# EAGLE design Mega_Shield-v13 (EAGLE 7.4.0)
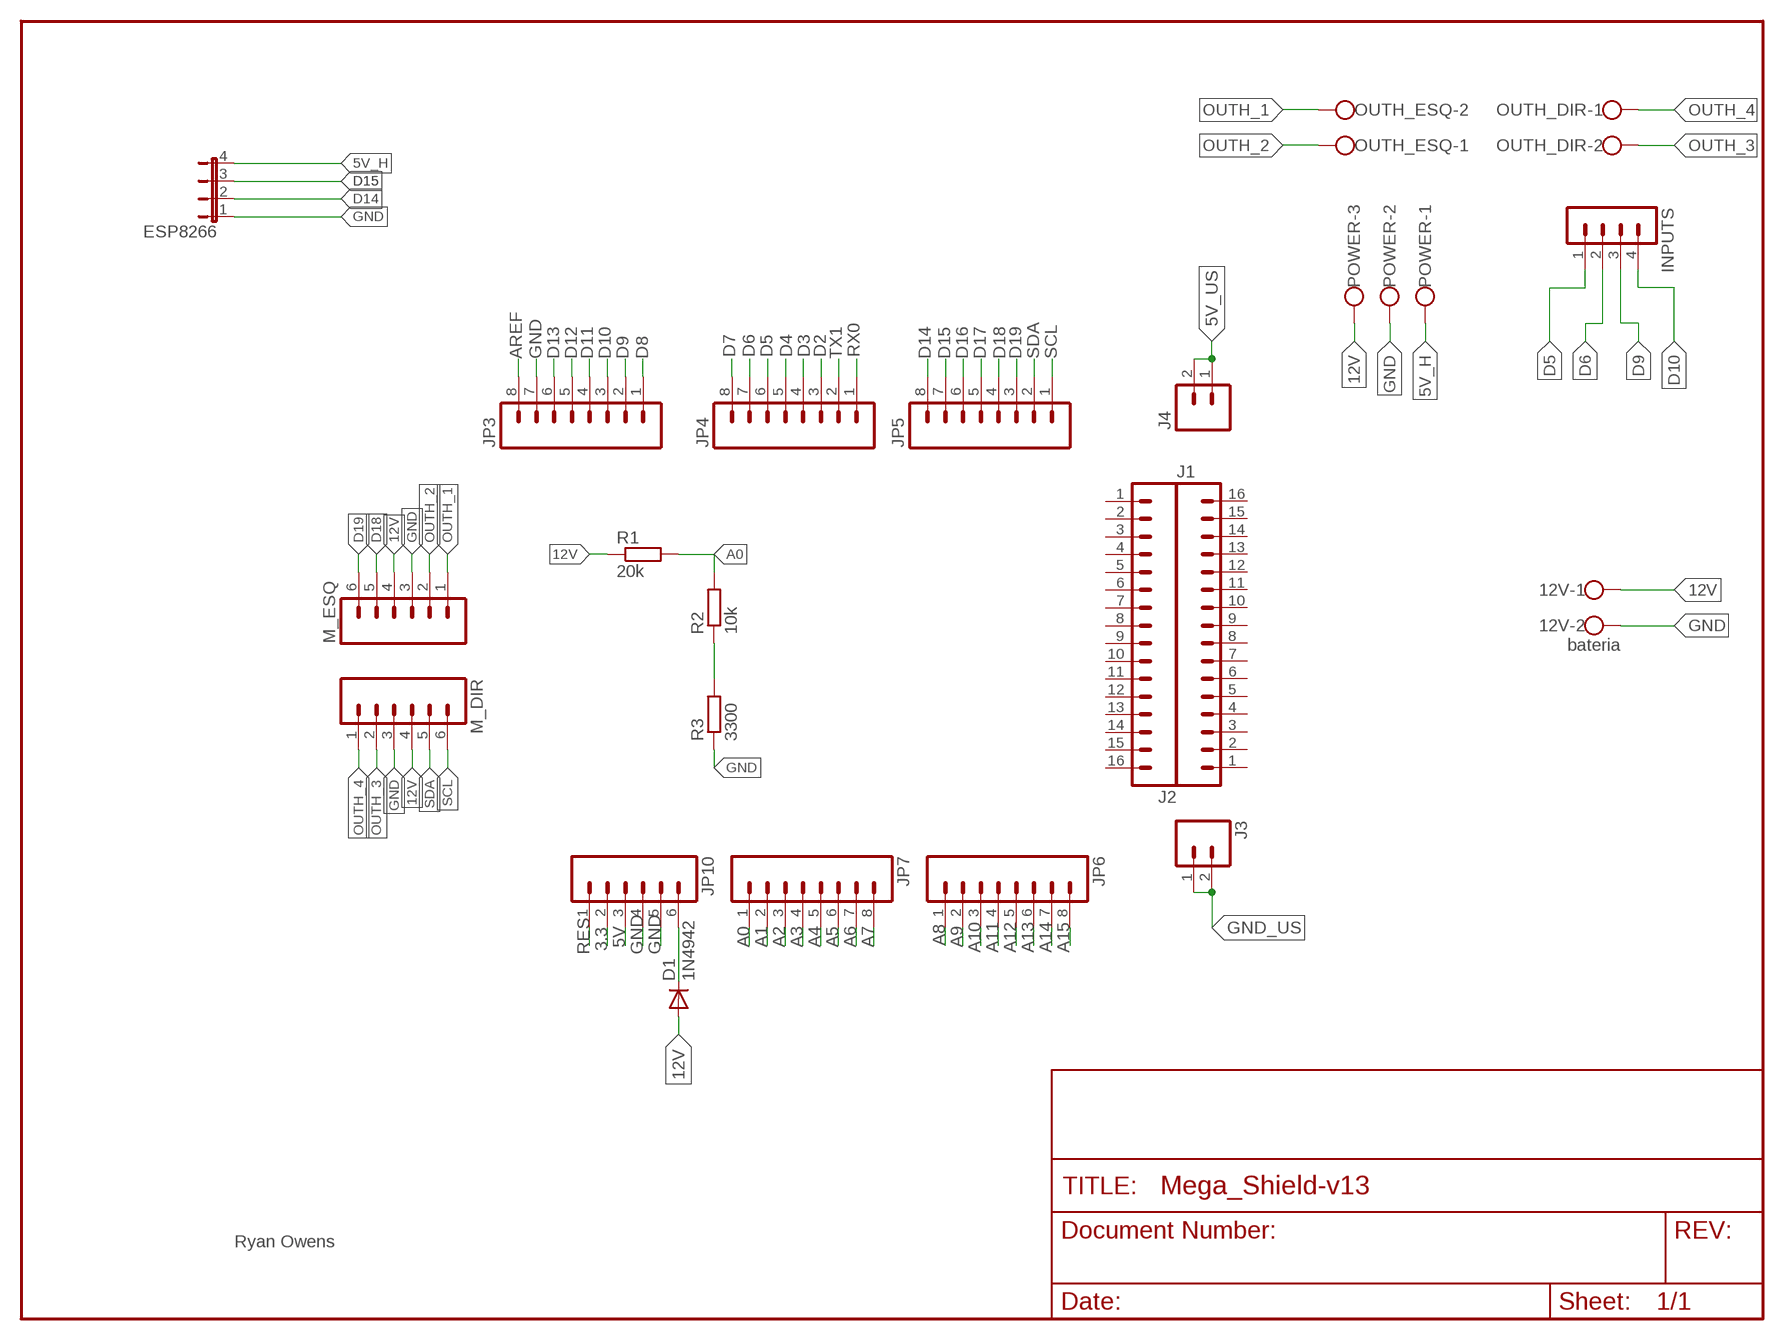
[diagram p0: schematic, sheet 1]

## Parts
12V  bateria  W237-102  [W237-102]
D1  1N4942  [DO41-10]
ESP8266  JP4E  [JP4]
INPUTS  MA04-1  [MA04-1]
J1  M16LOCK  [1X16_LOCK]
J2  M16LOCK  [1X16_LOCK]
J3  M02LOCK  [1X02_LOCK]
J4  M02LOCK  [1X02_LOCK]
JP3  M08LOCK  [1X08_LOCK]
JP4  M08LOCK  [1X08_LOCK]
JP5  M08LOCK  [1X08_LOCK]
JP6  M08LOCK  [1X08_LOCK]
JP7  M08LOCK  [1X08_LOCK]
JP10  M06LOCK  [1X06_LOCK]
M_DIR  M06LOCK  [1X06_LOCK]
M_ESQ  M06LOCK  [1X06_LOCK]
OUTH_DIR  W237-102  [W237-102]
OUTH_ESQ  W237-102  [W237-102]
POWER  W237-103  [W237-103]
R1  20k  R-EU_0207/10  [0207/10]
R2  10k  R-EU_0207/10  [0207/10]
R3  3300  R-EU_0207/10  [0207/10]

## Nets
3.3: JP10.2
5V: JP10.3
5V_H: ESP8266.4 POWER.1
5V_US: J4.1 J4.2
12V: 12V.1 D1.A M_DIR.4 M_ESQ.4 POWER.3 R1.1
A0: JP7.1 R1.2 R2.2
A1: JP7.2
A2: JP7.3
A3: JP7.4
A4: JP7.5
A5: JP7.6
A6: JP7.7
A7: JP7.8
A8: JP6.1
A9: JP6.2
A10: JP6.3
A11: JP6.4
A12: JP6.5
A13: JP6.6
A14: JP6.7
A15: JP6.8
AREF: JP3.8
D2: JP4.3
D3: JP4.4
D4: JP4.5
D5: INPUTS.1 JP4.6
D6: INPUTS.2 JP4.7
D7: JP4.8
D8: JP3.1
D9: INPUTS.3 JP3.2
D10: INPUTS.4 JP3.3
D11: JP3.4
D12: JP3.5
D13: JP3.6
D14: ESP8266.2 JP5.8
D15: ESP8266.3 JP5.7
D16: JP5.6
D17: JP5.5
D18: JP5.4 M_ESQ.5
D19: JP5.3 M_ESQ.6
GND: 12V.2 ESP8266.1 JP3.7 JP10.4 JP10.5 M_DIR.3 M_ESQ.3 POWER.2 R3.1
GND_US: J3.1 J3.2
N$2: R2.1 R3.2
N$8: D1.C JP10.6
OUTH_1: M_ESQ.1 OUTH_ESQ.2
OUTH_2: M_ESQ.2 OUTH_ESQ.1
OUTH_3: M_DIR.2 OUTH_DIR.2
OUTH_4: M_DIR.1 OUTH_DIR.1
RES: JP10.1
RX0: JP4.1
SCL: JP5.1 M_DIR.6
SDA: JP5.2 M_DIR.5
TX1: JP4.2
Unconnected: J1.1 J1.2 J1.3 J1.4 J1.5 J1.6 J1.7 J1.8 J1.9 J1.10 J1.11 J1.12 J1.13 J1.14 J1.15 J1.16 J2.1 J2.2 J2.3 J2.4 J2.5 J2.6 J2.7 J2.8 J2.9 J2.10 J2.11 J2.12 J2.13 J2.14 J2.15 J2.16

## Notes on the sheet
- Ryan Owens

## Library data of the parts
12V OUTH_DIR OUTH_ESQ = con-wago-500:W237-102: WAGO SCREW CLAMP; MPN: 237-102; OC_FARNELL: unknown; OC_NEWARK: 70K9898
D1 = diode:1N4942: DIODE 1.0 A, 200 V, 150 ns
ESP8266 = jumper:JP4E: JUMPER
INPUTS = con-lstb:MA04-1: PIN HEADER; OC_FARNELL: unknown; OC_NEWARK: unknown
J1 J2 = SparkFun-Connectors:M16: 1x16 .1" header
J3 J4 = SparkFun-Connectors:M02: Standard 2-pin 0.1" header. Use with - straight break away headers ( PRT-00116) - right angle break away headers (PRT-00553) - swiss pins (PRT-00743) - machine pins (PRT-00117) - female headers (PRT-00115) Molex polarized connector foot print use with: PRT-08233 with associated crimp pins and housings. 2.54_SCREWTERM for use with PRT-10571. 3.5mm Screw Terminal footprints for PRT-08084 5mm Screw Terminal footprints for use with PRT-08432
JP3-JP7 = SparkFun:M08: Header 8 Standard 8-pin 0.1" header. Use with straight break away headers (SKU : PRT-00116), right angle break away headers (PRT-00553), swiss pins (PRT-00743), machine pins (PRT-00117), and female headers (PRT-00115).
JP10 M_DIR M_ESQ = SparkFun:M06: Header 6 Standard 6-pin 0.1" header. Use with straight break away headers (SKU : PRT-00116), right angle break away headers (PRT-00553), swiss pins (PRT-00743), machine pins (PRT-00117), and female headers (PRT-00115). Molex polarized connector foot print use with SKU : PRT-08094 with associated crimp pins and housings. NOTES ON THE VARIANTS LOCK and LOCK_LONGPADS... This footprint was designed to help hold the alignment of a through-hole component (i.e. 6-pin header) while soldering it into place. You may notice that each hole has been shifted either up or down by 0.005 of an inch from it's more standard position (which is a perfectly straight line). This slight alteration caused the pins (the squares in the middle) to touch the edges of the holes. Because they are alternating, it causes a "brace" to hold the component in place. 0.005 has proven to be the perfect amount of "off-center" position when using our standard breakaway headers. Although looks a little odd when you look at the bare footprint, once you have a header in there, the alteration is very hard to notice. Also, if you push a header all the way into place, it is covered up entirely on the bottom side. This idea of altering the position of holes to aid alignment will be further integrated into the Sparkfun Library for other footprints. It can help hold any component with 3 or more connection pins.
POWER = con-wago-500:W237-103: WAGO SCREW CLAMP; MPN: 237-103; OC_FARNELL: unknown; OC_NEWARK: 18M7116
R1-R3 = resistor:R-EU_: RESISTOR, European symbol

## Board
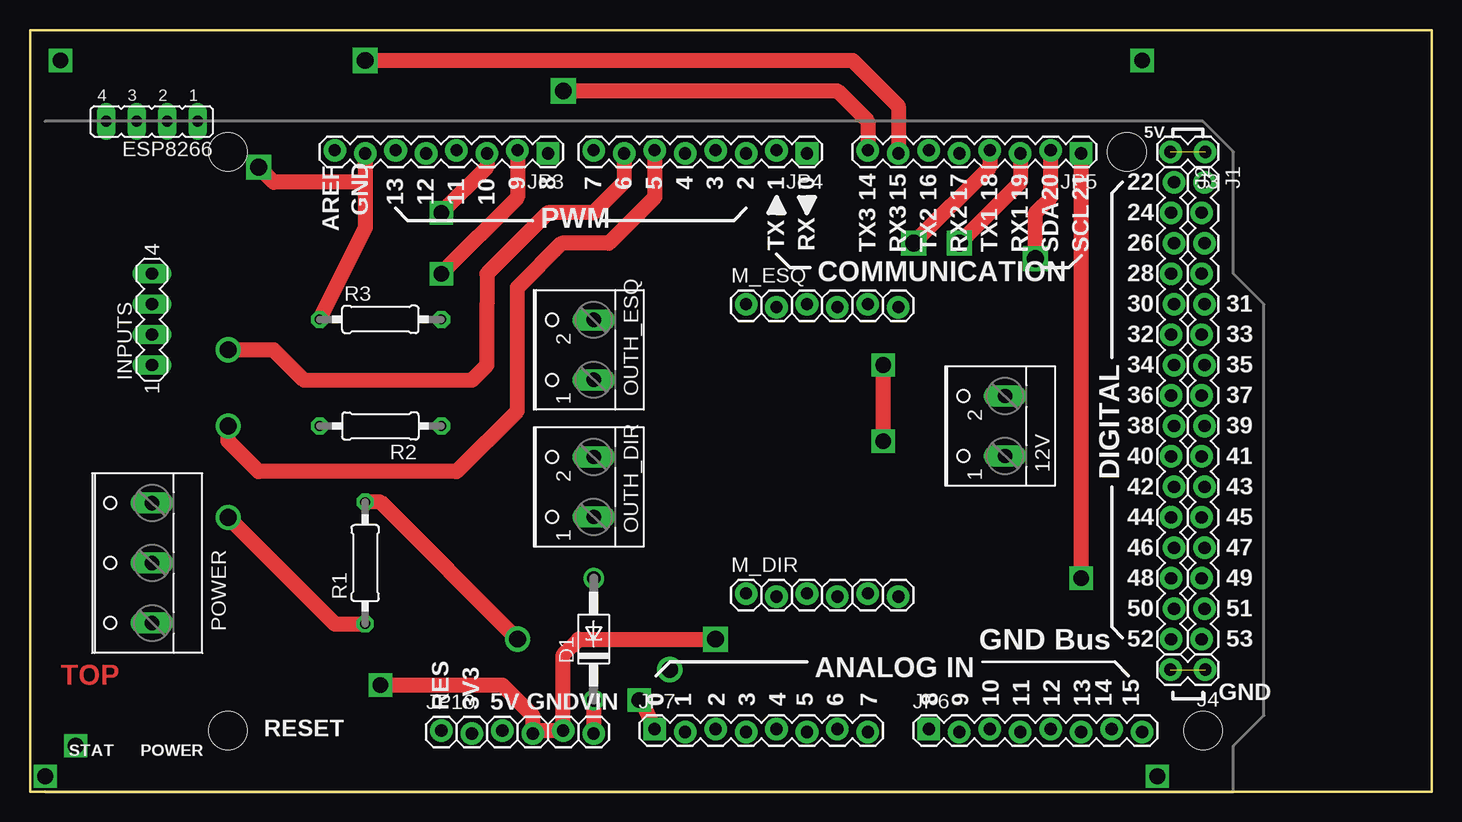
[diagram p1: board, top side]
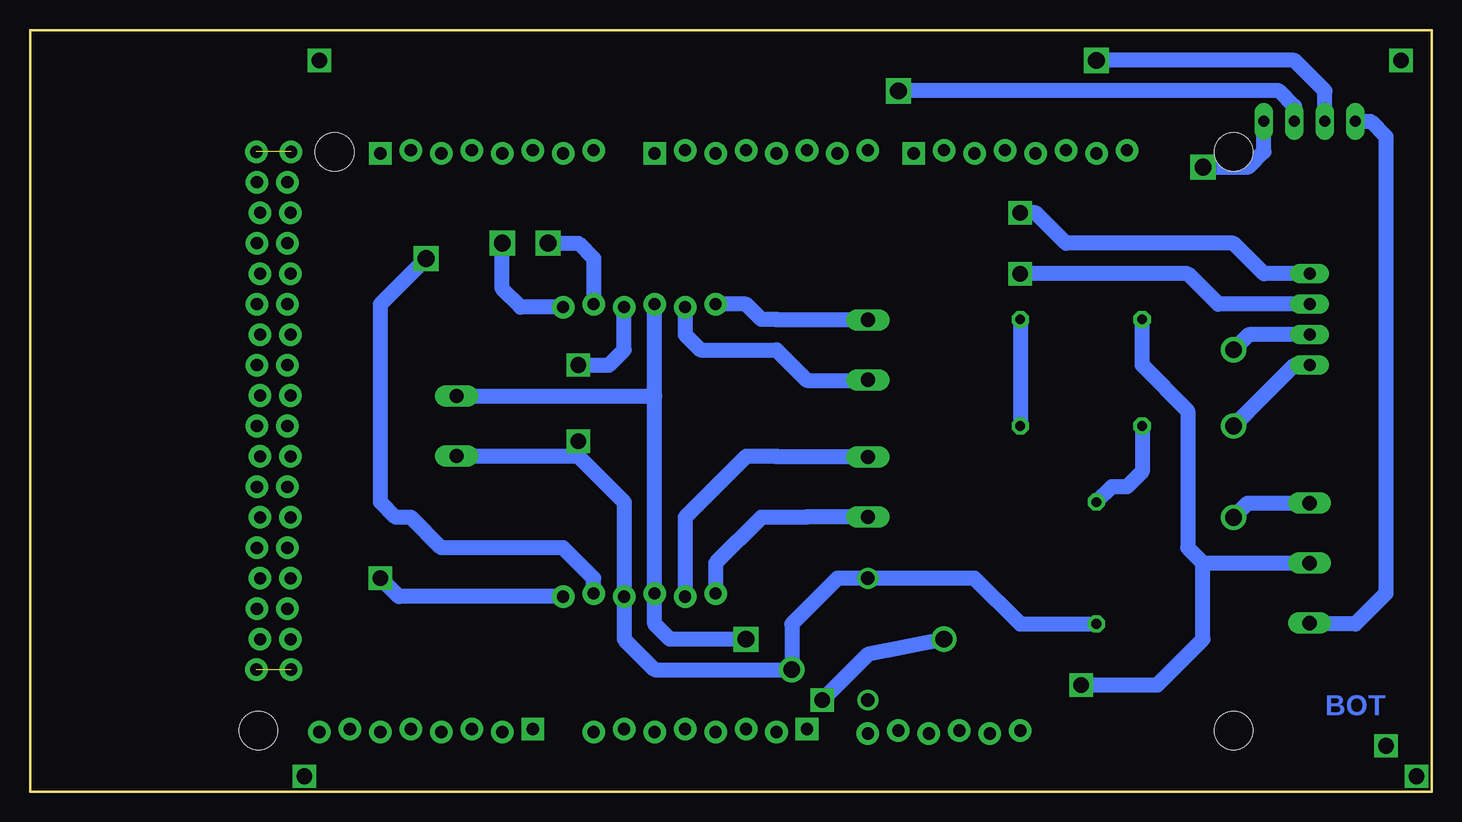
[diagram p2: board, bottom side, seen from below]

Size 116.84 x 63.5 mm. Coordinates in mm from the lower left corner, seen from the top.
Outline: 0,0 116.84,0 116.84,63.5 0,63.5 0,0
Copper layers (1*16): Top 0.035mm / dielectric 1.5mm / Bottom 0.035mm
Design rules "SparkFun *": minimum track width 42mil, minimum drill 34mil, track to track 34mil, track to pad 34mil, pad to pad 34mil, via to via 34mil, smd to smd 8mil, copper to edge 10mil, drill to drill 8mil, minimum pad ring 12mil, minimum via ring 10mil, stop-mask expansion 4mil, vias tented up to drill 25mil, thermal gap 10mil
Holes 3.2 mm at 16.51,53.34 16.51,5.08 91.44,53.34 97.79,5.08

### Footprints (pad centres in the part's own frame; a part is rotated, then mirrored left to right if it is on the bottom)
W237-102 = drill 1.194 long: 1 -2.5,-1.27; 2 2.5,-1.27
DO41-10 = drill 1.118: A 5.08,0; C -5.08,0
JP4 = drill 0.914 long: 1 -3.81,0; 2 -1.27,0; 3 1.27,0; 4 3.81,0
MA04-1 = drill 1.016 long: 1 -3.81,0; 2 -1.27,0; 3 1.27,0; 4 3.81,0
1X16_LOCK = drill 1.016 pad 1.88: 1 0,0.127; 2 2.54,-0.127; 3 5.08,0.127; 4 7.62,-0.127; 5 10.16,0.127; 6 12.7,-0.127; 7 15.24,0.127; 8 17.78,-0.127; 9 20.32,0.127; 10 22.86,-0.127; 11 25.4,0.127; 12 27.94,-0.127; 13 30.48,0.127; 14 33.02,-0.127; 15 35.56,0.127; 16 38.1,-0.127
1X02_LOCK = drill 1.016 pad 1.88: 1 -0.178,0; 2 2.718,0
1X08_LOCK = drill 1.016 pad 1.88 square: 1 0,0.127 | drill 1.016 pad 1.88: 2 2.54,-0.127; 3 5.08,0.127; 4 7.62,-0.127; 5 10.16,0.127; 6 12.7,-0.127; 7 15.24,0.127; 8 17.78,-0.127
1X06_LOCK = drill 1.016 pad 1.88: 1 0,0; 2 2.54,-0.254; 3 5.08,0; 4 7.62,-0.254; 5 10.16,0; 6 12.7,-0.254
W237-103 = drill 1.194 long: 1 -5,-1.29; 2 0,-1.29; 3 5,-1.29
0207/10 = drill 0.813 octagon: 1 -5.08,0; 2 5.08,0

### Placement (x,y rotation side)
12V  80.01,30.48 90 top
D1  46.99,12.7 90 top
ESP8266  10.16,55.88 180 top
INPUTS  10.16,39.37 90 top
J1  97.79,50.8 270 top
J2  95.25,50.8 270 top
J3  97.79,53.34 180 top
J4  97.79,10.16 180 top
JP3  43.18,53.34 180 top
JP4  64.77,53.34 180 top
JP5  87.63,53.34 180 top
JP6  74.93,5.08 0 top
JP7  52.07,5.08 0 top
JP10  34.29,5.08 0 top
M_DIR  59.69,16.51 0 top
M_ESQ  59.69,40.64 0 top
OUTH_DIR  45.72,25.4 90 top
OUTH_ESQ  45.72,36.83 90 top
POWER  8.89,19.05 90 top
R1  27.94,19.05 90 top
R2  29.21,30.48 180 top
R3  29.21,39.37 0 top

### Tracks (layer width: path | path; a pad name or v marks a point on that pad's centre or on a via)
5V_H
  Bottom 1.27: ESP8266.4 5.08,55.88 3.81,54.61 3.81,16.51 6.35,13.97 10.1,13.97 POWER.1
5V_US  (1 unrouted)
12V  (via drill 0.9, 1.3, 1.4)
  Top 1.27: v71.12,35.56 v71.12,29.21 | v16.51,22.86 25.4,13.97 R1.1
  Bottom 0.813: 71.16,27.98 71.12,27.94 v71.12,29.21
  Bottom 1.27: 12V.1 71.16,27.98 | 71.12,27.94 67.31,24.13 M_DIR.4 67.31,12.7 64.77,10.16 v53.34,10.16 53.34,13.97 49.53,17.78 D1.A 38.1,17.78 34.29,13.97 R1.1 | v71.12,35.56 68.58,35.56 67.31,36.83 M_ESQ.4 | v16.51,22.86 15.32,24.05 POWER.3
A0  (via drill 0.9, 1.3, 1.4)
  Top 0.813: v50.8,7.62 50.93,7.62
  Top 1.27: 50.93,7.62 JP7.1 | v40.64,12.7 29.21,24.13 R1.2
  Bottom 1.27: R2.2 24.13,26.67 25.4,25.4 26.67,25.4 R1.2 | v40.64,12.7 46.99,11.43 v50.8,7.62
D5  (via drill 1.2, 1.4)
  Top 1.27: JP4.6 52.07,49.53 48.26,45.72 44.32,45.72 40.64,42.04 40.64,31.75 35.56,26.67 19.05,26.67 16.51,29.21 v16.51,30.48
  Bottom 1.27: 15.24,31.75 v16.51,30.48 11.43,35.56 INPUTS.1
D6  (via drill 0.6, 1.2, 1.3, 1.4)
  Top 0.813: 38.1,40.64 38.1,41.91
  Top 1.27: JP4.7 49.53,50.8 46.99,48.26 43.18,48.26 38.1,43.18 38.1,40.64 38.1,35.56 36.83,34.29 22.86,34.29 20.32,36.83 v16.51,36.83
  Bottom 1.27: INPUTS.2 15.24,38.1 v16.51,36.83
D9  (via drill 0.9, 1.3)
  Top 1.27: JP3.2 40.64,49.53 v34.29,43.18
  Bottom 1.27: INPUTS.3 17.78,40.64 20.32,43.18 v34.29,43.18
D10  (via drill 0.9, 1.3)
  Top 1.27: JP3.3 38.1,52.07 v34.29,48.26
  Bottom 1.27: INPUTS.4 13.97,43.18 16.51,45.72 30.48,45.72 33.02,48.26 v34.29,48.26
D14  (via drill 1.4)
  Top 1.27: v44.45,58.42 67.31,58.42 69.85,55.88 JP5.8
  Bottom 1.27: ESP8266.2 11.43,57.15 12.7,58.42 v44.45,58.42
D15  (via drill 1.4)
  Top 1.27: v27.94,60.96 68.58,60.96 72.39,57.15 JP5.7
  Bottom 1.27: ESP8266.3 8.89,58.42 11.43,60.96 v27.94,60.96
D18  (via drill 1.4)
  Top 1.27: JP5.4 80.01,52.07 v73.66,45.72
  Bottom 1.27: v73.66,45.72 71.12,45.72 69.85,44.45 M_ESQ.5
D19  (via drill 0.9, 1.4)
  Top 1.27: JP5.3 82.55,50.8 v77.47,45.72
  Bottom 1.27: M_ESQ.6 75.95,40.39 77.47,41.91 v77.47,45.72
GND  (via drill 0.6, 0.9, 1, 1.3, 1.4)
  Top 0.813: 42.16,5.08 JP10.4
  Top 1.27: 27.94,50.8 27.94,46.99 R3.1 | v29.21,8.89 39.37,8.89 41.91,6.35 JP10.4 | 42.16,5.08 JP10.5 44.45,11.43 45.72,12.7 v57.15,12.7 | JP3.7 27.94,50.8 | 27.94,50.8 20.32,50.8 v19.05,52.07
  Bottom 0.813: 64.81,32.98 64.77,33.02
  Bottom 1.27: R3.1 24.13,35.56 20.32,31.75 20.32,20.32 19.05,19.05 | v57.15,12.7 63.5,12.7 64.77,13.97 M_DIR.3 64.77,33.02 M_ESQ.3 | 12V.2 64.81,32.98 | v19.05,52.07 15.24,52.07 13.97,53.34 ESP8266.1 | 19.05,19.05 POWER.2 | v29.21,8.89 22.86,8.89 19.05,12.7 19.05,19.05
GND_US  (1 unrouted)
N$2
  Bottom 1.27: R3.2 R2.1
N$3  (via drill 1.3)
  other vias: 2.54,60.96
N$4  (via drill 1.3)
  other vias: 92.71,60.96
N$5  (via drill 1.3)
  other vias: 93.98,1.27
N$6  (via drill 1.3)
  other vias: 1.27,1.27
N$7  (via drill 1.3)
  other vias: 3.81,3.81
N$8
  Top 1.27: D1.C JP10.6
OUTH_1
  Bottom 0.813: 54.57,39.33 54.61,39.37
  Bottom 1.27: OUTH_ESQ.2 54.57,39.33 | 54.61,39.37 55.88,39.37 57.15,40.64 M_ESQ.1
OUTH_2
  Bottom 0.813: 47.03,34.29 OUTH_ESQ.1
  Bottom 1.27: M_ESQ.2 62.23,38.1 60.96,36.83 54.61,36.83 52.07,34.29 47.03,34.29
OUTH_3
  Bottom 1.27: OUTH_DIR.2 54.57,27.9 54.61,27.94 57.15,27.94 62.23,22.86 M_DIR.2
OUTH_4
  Bottom 1.27: OUTH_DIR.1 52.03,22.9 52.07,22.86 55.88,22.86 59.69,19.05 M_DIR.1
SCL  (via drill 0.9, 1.3)
  Top 1.27: v87.63,17.78 JP5.1
  Bottom 1.27: M_DIR.6 86.11,16.26 v87.63,17.78
SDA  (via drill 0.9, 1.4)
  Top 1.27: v83.82,44.45 83.82,48.26 85.09,49.53 JP5.2
  Bottom 1.27: M_DIR.5 69.85,17.78 72.39,20.32 82.55,20.32 85.09,22.86 86.36,22.86 87.63,24.13 87.63,40.64 v83.82,44.45

### Text on the board
Top: TOP
Bottom: BOT
tPlace: 5V | 9 | 8 | 7 | 6 | 5 | 4 | 3 | 2 | 1 | 0 | 22 | 14 | 15 | 16 | 17 | 18 | 19 | 20 | 21 | 13 | 12 | 11 | 10 | GND | 24 | AREF | PWM | TX | RX | 26 | TX3 | RX3 | TX2 | RX2 | TX1 | RX1 | SDA | SCL | COMMUNICATION | 28 | 30 | 31 | 32 | 33 | 34 | 35 | 36 | 37 | 38 | 39 | 40 | 41 | DIGITAL | 42 | 43 | 44 | 45 | 46 | 47 | 48 | 49 | 50 | 51 | 52 | 53 | GND Bus | ANALOG IN | 0 | 1 | 2 | 3 | 4 | 5 | 6 | 7 | 8 | 9 | 10 | 11 | 12 | 13 | 14 | 15 | GND | RES | 3V3 | 5V | GND | VIN | RESET | STAT | POWER